# EAGLE design Hydra OSP (EAGLE 8.1.1)
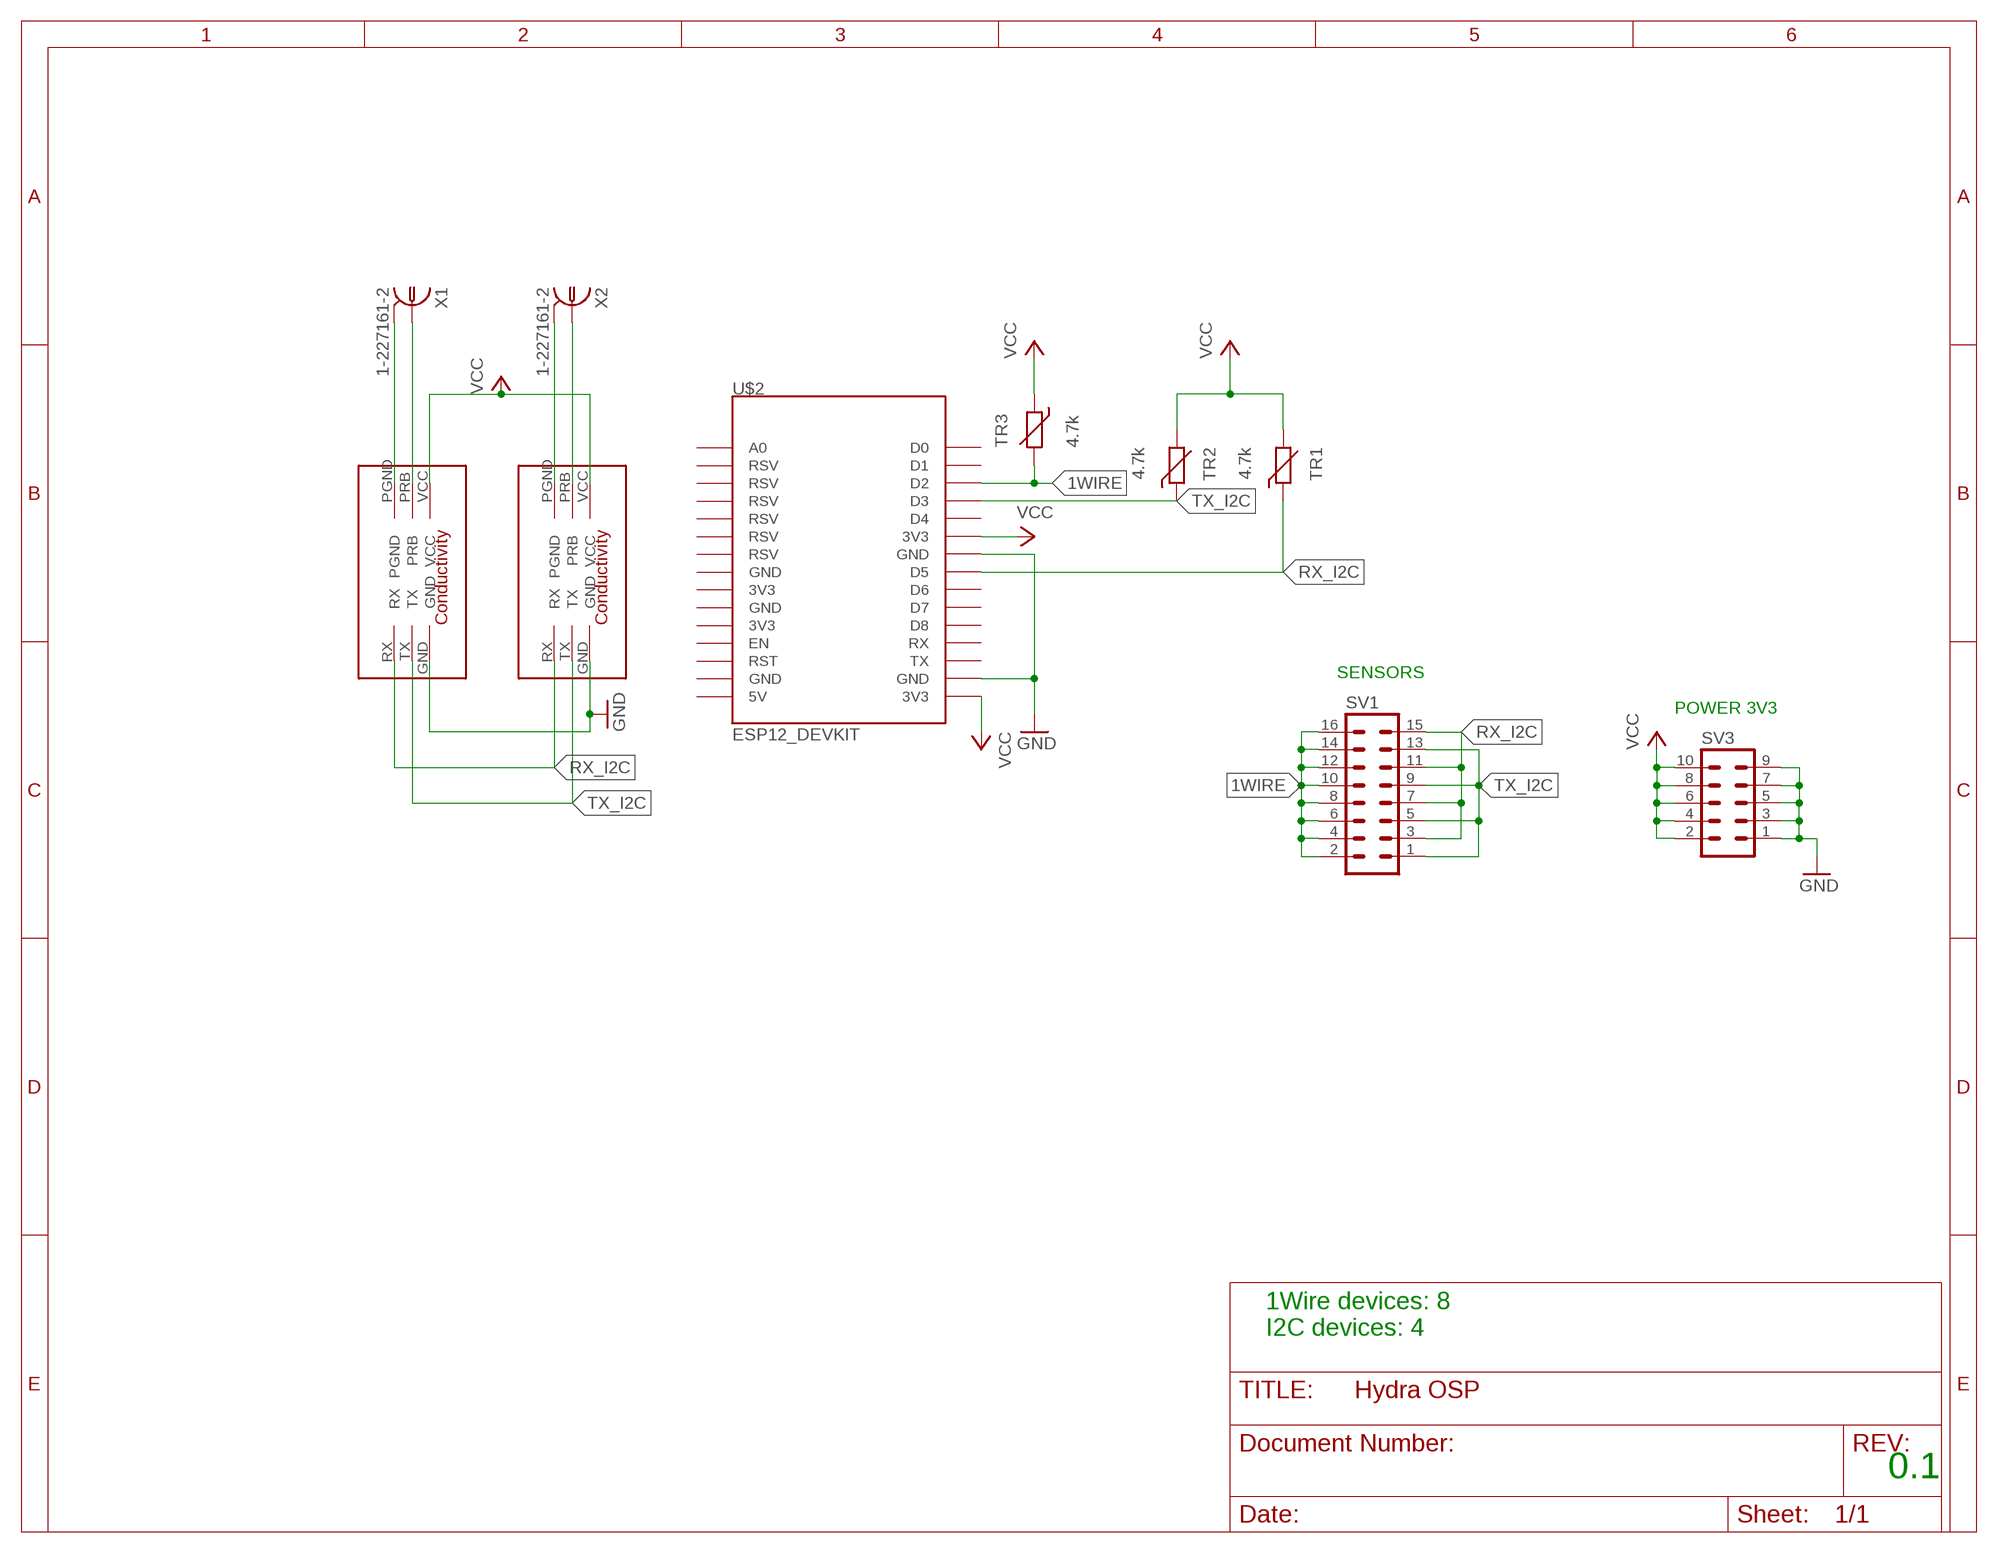
[diagram p0: schematic, sheet 1]

## Parts
SV1  MA08-2  [MA08-2]
SV3  MA05-2  [MA05-2]
TR1  4.7k  THERMISTOR_R-5  [R-5]
TR2  4.7k  THERMISTOR_R-5  [R-5]
TR3  4.7k  THERMISTOR_R-5  [R-5]
U$1  ATLSCI_COND  [ATLAS_SCI_COND]
U$2  ESP12_DEVKIT  [ESP12_DEVKIT]
U$3  ATLSCI_COND  [ATLAS_SCI_COND]
X1  1-227161-2  [AMP_227161]
X2  1-227161-2  [AMP_227161]

## Nets
1WIRE: SV1.2 SV1.4 SV1.6 SV1.8 SV1.10 SV1.12 SV1.14 SV1.16 TR3.2 U$2.D2
GND: SV3.1 SV3.3 SV3.5 SV3.7 SV3.9 U$1.GND U$2.GND@2(GND) U$2.GND@3(GND) U$3.GND
N$1: U$1.PGND X1.2
N$2: U$1.PRB X1.1
N$3: U$3.PRB X2.1
N$4: U$3.PGND X2.2
RX_I2C: SV1.3 SV1.7 SV1.11 SV1.15 TR1.1 U$1.RX U$2.D5 U$3.RX
TX_I2C: SV1.1 SV1.5 SV1.9 SV1.13 TR2.1 U$1.TX U$2.D3 U$3.TX
VCC: SV3.2 SV3.4 SV3.6 SV3.8 SV3.10 TR1.2 TR2.2 TR3.1 U$1.VCC U$2.3V3@1(3V3) U$2.3V3@2(3V3) U$3.VCC
Unconnected: U$2.3V3@0(3V3) U$2.3V3@3(3V3) U$2.5V U$2.A0 U$2.D0 U$2.D1 U$2.D4 U$2.D6 U$2.D7 U$2.D8 U$2.EN U$2.GND@0(GND) U$2.GND@1(GND) U$2.GND@4(GND) U$2.RST U$2.RSV@0(RSV) U$2.RSV@1(RSV) U$2.RSV@2(RSV) U$2.RSV@3(RSV) U$2.RSV@4(RSV) U$2.RSV@5(RSV) U$2.RX U$2.TX

## Notes on the sheet
- SENSORS
- POWER 3V3
- 1Wire devices: 8
  I2C devices: 4
- 0.1

## Library data of the parts
SV1 = con-lstb:MA08-2: PIN HEADER; OC_FARNELL: unknown; OC_NEWARK: unknown
SV3 = con-lstb:MA05-2: PIN HEADER; OC_FARNELL: unknown; OC_NEWARK: unknown
TR1-TR3 = discrete:THERMISTOR_: Thermo Resistor
U$1 U$3 = cond:ATLSCI_COND
U$2 = ESP12_DEVKIT:ESP12_DEVKIT: ESP12 DEVKIT BOARD
X1 X2 = con-coax:?227161*: JACK, RIGHT ANGLE, 50 OHM, PCB, BNC Source: amp_227161.pdf; OC_FARNELL: unknown; OC_NEWARK: unknown

## Board
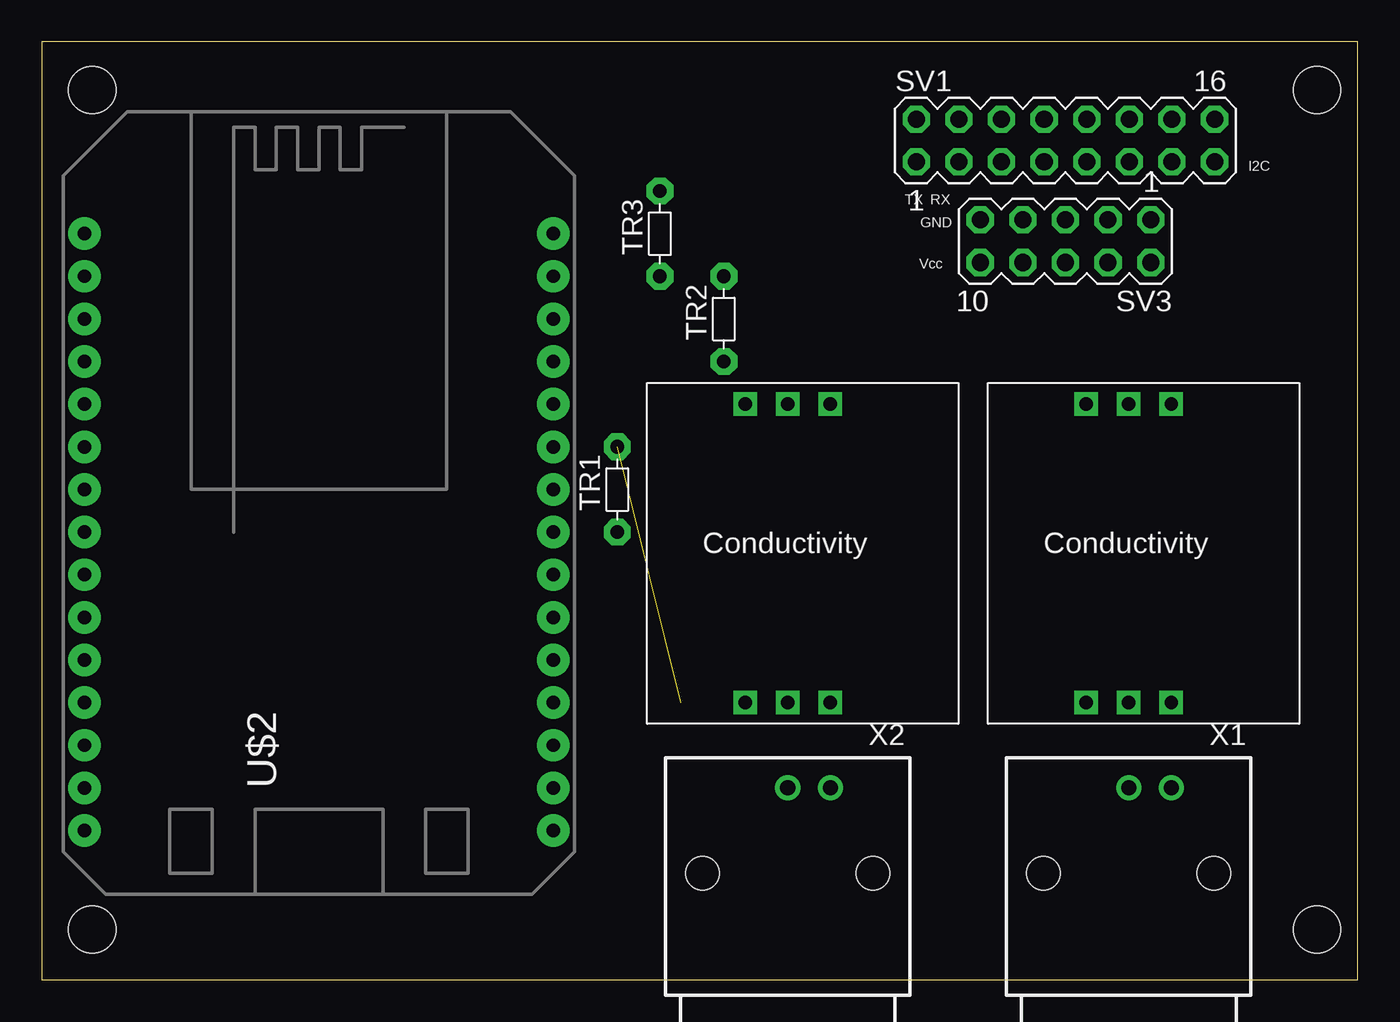
[diagram p1: board, top side]
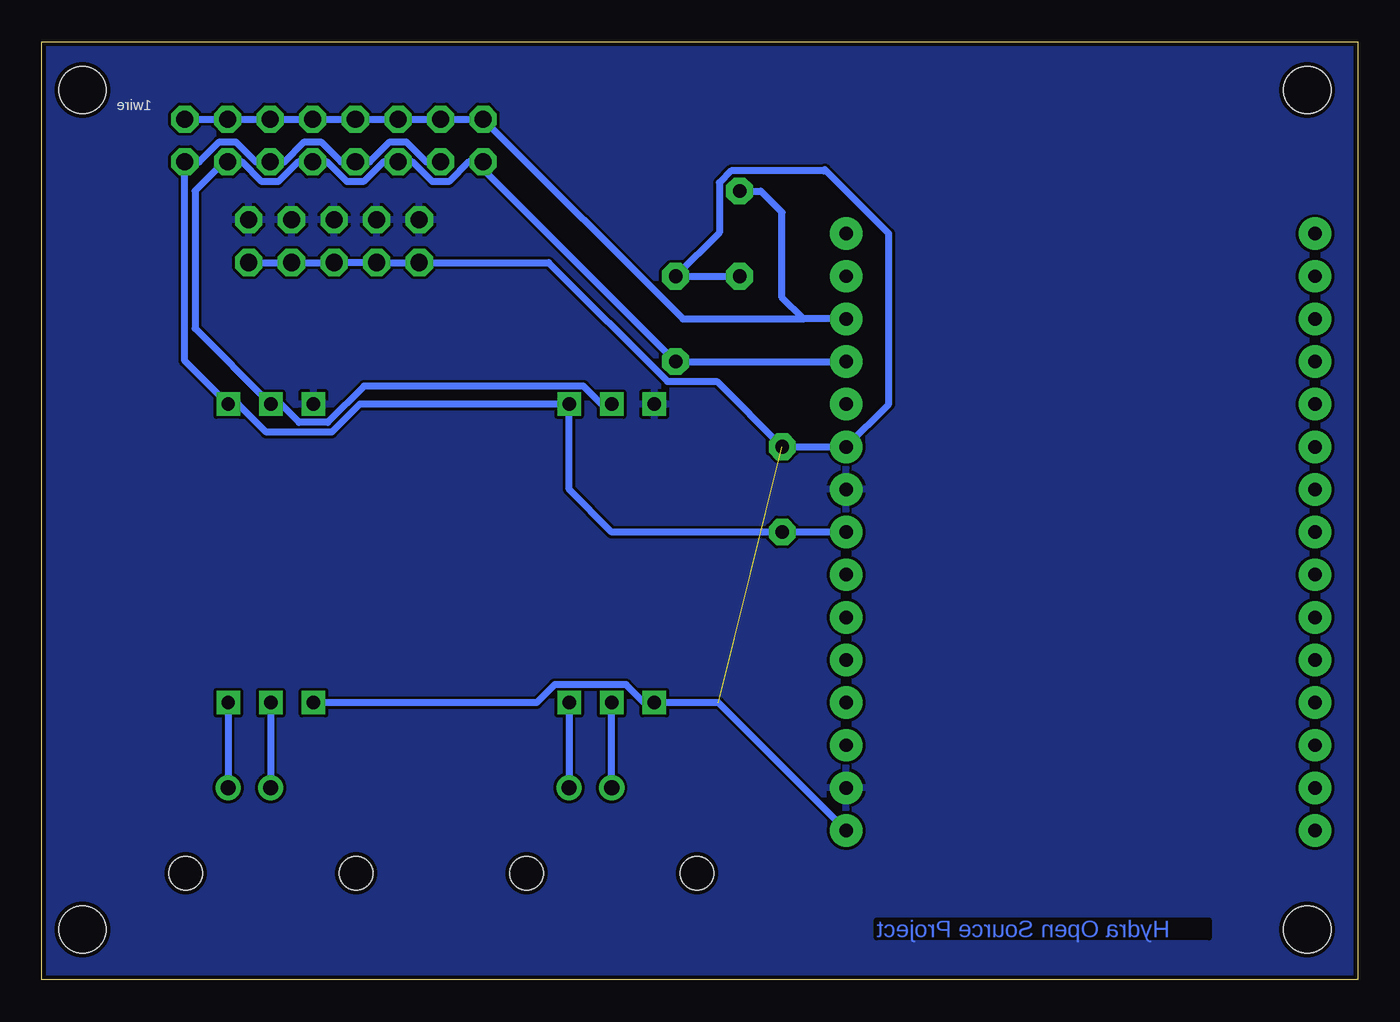
[diagram p2: board, bottom side, seen from below]

Size 78.41 x 55.87 mm. Coordinates in mm from the lower left corner, seen from the top.
Outline: 0,0 78.41,0 78.41,55.87 0,55.87 0,0
Copper layers 16: Bottom 0.035mm
Design rules "eC_1Layer_PClass5_BaseCopperO35": minimum track width 0.175mm, minimum drill 0.35mm, track to track 0.175mm, track to pad 0.175mm, pad to pad 0.175mm, via to via 0.175mm, smd to smd 0mil, copper to edge 0.25mm, drill to drill 0.35mm, minimum pad ring 0.3mm, minimum via ring 0.3mm, stop-mask expansion 0mil, vias tented up to drill 0.45mm, thermal gap 0.2mm
Holes 2.8 mm at 3,53 76,53 76,3 3,3

### Footprints (pad centres in the part's own frame; a part is rotated, then mirrored left to right if it is on the bottom)
MA08-2 = drill 1.016 octagon: 1 -8.89,-1.27; 2 -8.89,1.27; 3 -6.35,-1.27; 4 -6.35,1.27; 5 -3.81,-1.27; 6 -3.81,1.27; 7 -1.27,-1.27; 8 -1.27,1.27; 9 1.27,-1.27; 10 1.27,1.27; 11 3.81,-1.27; 12 3.81,1.27; 13 6.35,-1.27; 14 6.35,1.27; 15 8.89,-1.27; 16 8.89,1.27
MA05-2 = drill 1.016 octagon: 1 -5.08,-1.27; 2 -5.08,1.27; 3 -2.54,-1.27; 4 -2.54,1.27; 5 0,-1.27; 6 0,1.27; 7 2.54,-1.27; 8 2.54,1.27; 9 5.08,-1.27; 10 5.08,1.27
R-5 = drill 0.813 pad 1.6 octagon: 1 -2.54,0; 2 2.54,0
ATLAS_SCI_COND = drill 0.8 square: GND -2.54,8.89; PGND 2.54,-8.89; PRB 0,-8.89; RX 2.54,8.89; TX 0,8.89; VCC -2.54,-8.89
ESP12_DEVKIT = drill 0.8 pad 1.93: 3V3@0 -13.97,-7.62; 3V3@1 13.97,5.08; 3V3@2 13.97,-17.78; 3V3@3 -13.97,-2.54; 5V -13.97,-17.78; A0 -13.97,17.78; D0 13.97,17.78; D1 13.97,15.24; D2 13.97,12.7; D3 13.97,10.16; D4 13.97,7.62; D5 13.97,0; D6 13.97,-2.54; D7 13.97,-5.08; D8 13.97,-7.62; EN -13.97,-10.16; GND@0 -13.97,-5.08; GND@1 -13.97,-15.24; GND@2 13.97,2.54; GND@3 13.97,-15.24; GND@4 -13.97,0; RST -13.97,-12.7; RSV@0 -13.97,15.24; RSV@1 -13.97,12.7; RSV@2 -13.97,10.16; RSV@3 -13.97,7.62; RSV@4 -13.97,5.08; RSV@5 -13.97,2.54; RX 13.97,-10.16; TX 13.97,-12.7
AMP_227161 = drill 0.9 pad 1.27: 1 0,-5.08; 2 -2.54,-5.08 | hole 2: -5.08,0; 5.08,0

### Placement (x,y rotation side)
SV1  61,50 0 top
SV3  61,44 180 top
TR1  34.29,29.21 90 top
TR2  40.64,39.37 90 top
TR3  36.83,44.45 90 top
U$1  64.77,25.4 0 top
U$2  16.51,26.67 0 top
U$3  44.45,25.4 0 top
X1  64.77,6.35 180 top
X2  44.45,6.35 180 top

### Tracks (layer width: path | path; a pad name or v marks a point on that pad's centre or on a via)
1WIRE
  Bottom 0.406: TR3.2 35.56,46.99 34.29,45.72 34.29,40.64 33.02,39.37 | U$2.D2 33.02,39.37 | SV1.16 SV1.14 SV1.12 SV1.10 SV1.8 SV1.6 SV1.4 SV1.2 40.21,39.37 33.02,39.37
GND
  pour Bottom: 0,0 78.74,0 78.74,55.88 0,55.88
N$1
  Bottom 0.406: U$1.PGND X1.2
N$2
  Bottom 0.406: U$1.PRB X1.1
N$3
  Bottom 0.406: X2.1 U$3.PRB
N$4
  Bottom 0.406: U$3.PGND X2.2
RX_I2C
  Bottom 0.406: U$2.D5 TR1.1 44.45,26.67 46.99,29.21 U$3.RX 59.47,34.29 61.13,32.63 65.05,32.63 66.7,34.29 U$1.RX 69.89,36.87 SV1.15 69.03,48.73 67.84,49.92 66.85,49.92 65.67,48.73 SV1.11 63.95,48.73 62.77,49.92 61.77,49.92 60.59,48.73 SV1.7 58.88,48.73 57.69,49.92 56.69,49.92 55.51,48.73 SV1.3
TX_I2C
  Bottom 0.406: U$2.D3 TR2.1 52.11,48.3 SV1.1 52.97,48.73 54.16,47.54 55.14,47.54 56.33,48.73 SV1.5 58.05,48.73 59.24,47.54 60.22,47.54 61.41,48.73 SV1.9 63.13,48.73 64.32,47.54 65.3,47.54 66.49,48.73 SV1.13 67.55,48.73 69.28,47 69.28,38.8 U$1.TX 64.17,34.29 63.09,33.21 61.37,33.21 59.22,35.37 46.13,35.37 45.05,34.29 U$3.TX
VCC  (1 unrouted)
  Bottom 0.406: TR3.1 TR2.2 38.04,44.51 38.04,47.49 37.33,48.2 31.8,48.2 31.75,48.26 | 31.75,48.26 | 31.75,48.26 27.94,44.45 27.94,34.29 U$2.3V3@1 TR1.2 38.19,35.65 41.13,35.65 48.21,42.73 SV3.10 SV3.8 SV3.6 SV3.4 SV3.2 | U$2.3V3@2 38.1,16.51 U$3.VCC 42.52,16.51 43.59,17.59 47.85,17.59 48.92,16.51 U$1.VCC

### Text on the board
Bottom: Hydra Open Source Project
tPlace: I2C | TX | RX | Vcc
bPlace: 1wire
tNames: GND